# Altium schematic sheet Sheet1.SchDoc
size B; SheetNumber: 1; SheetTotal: 1
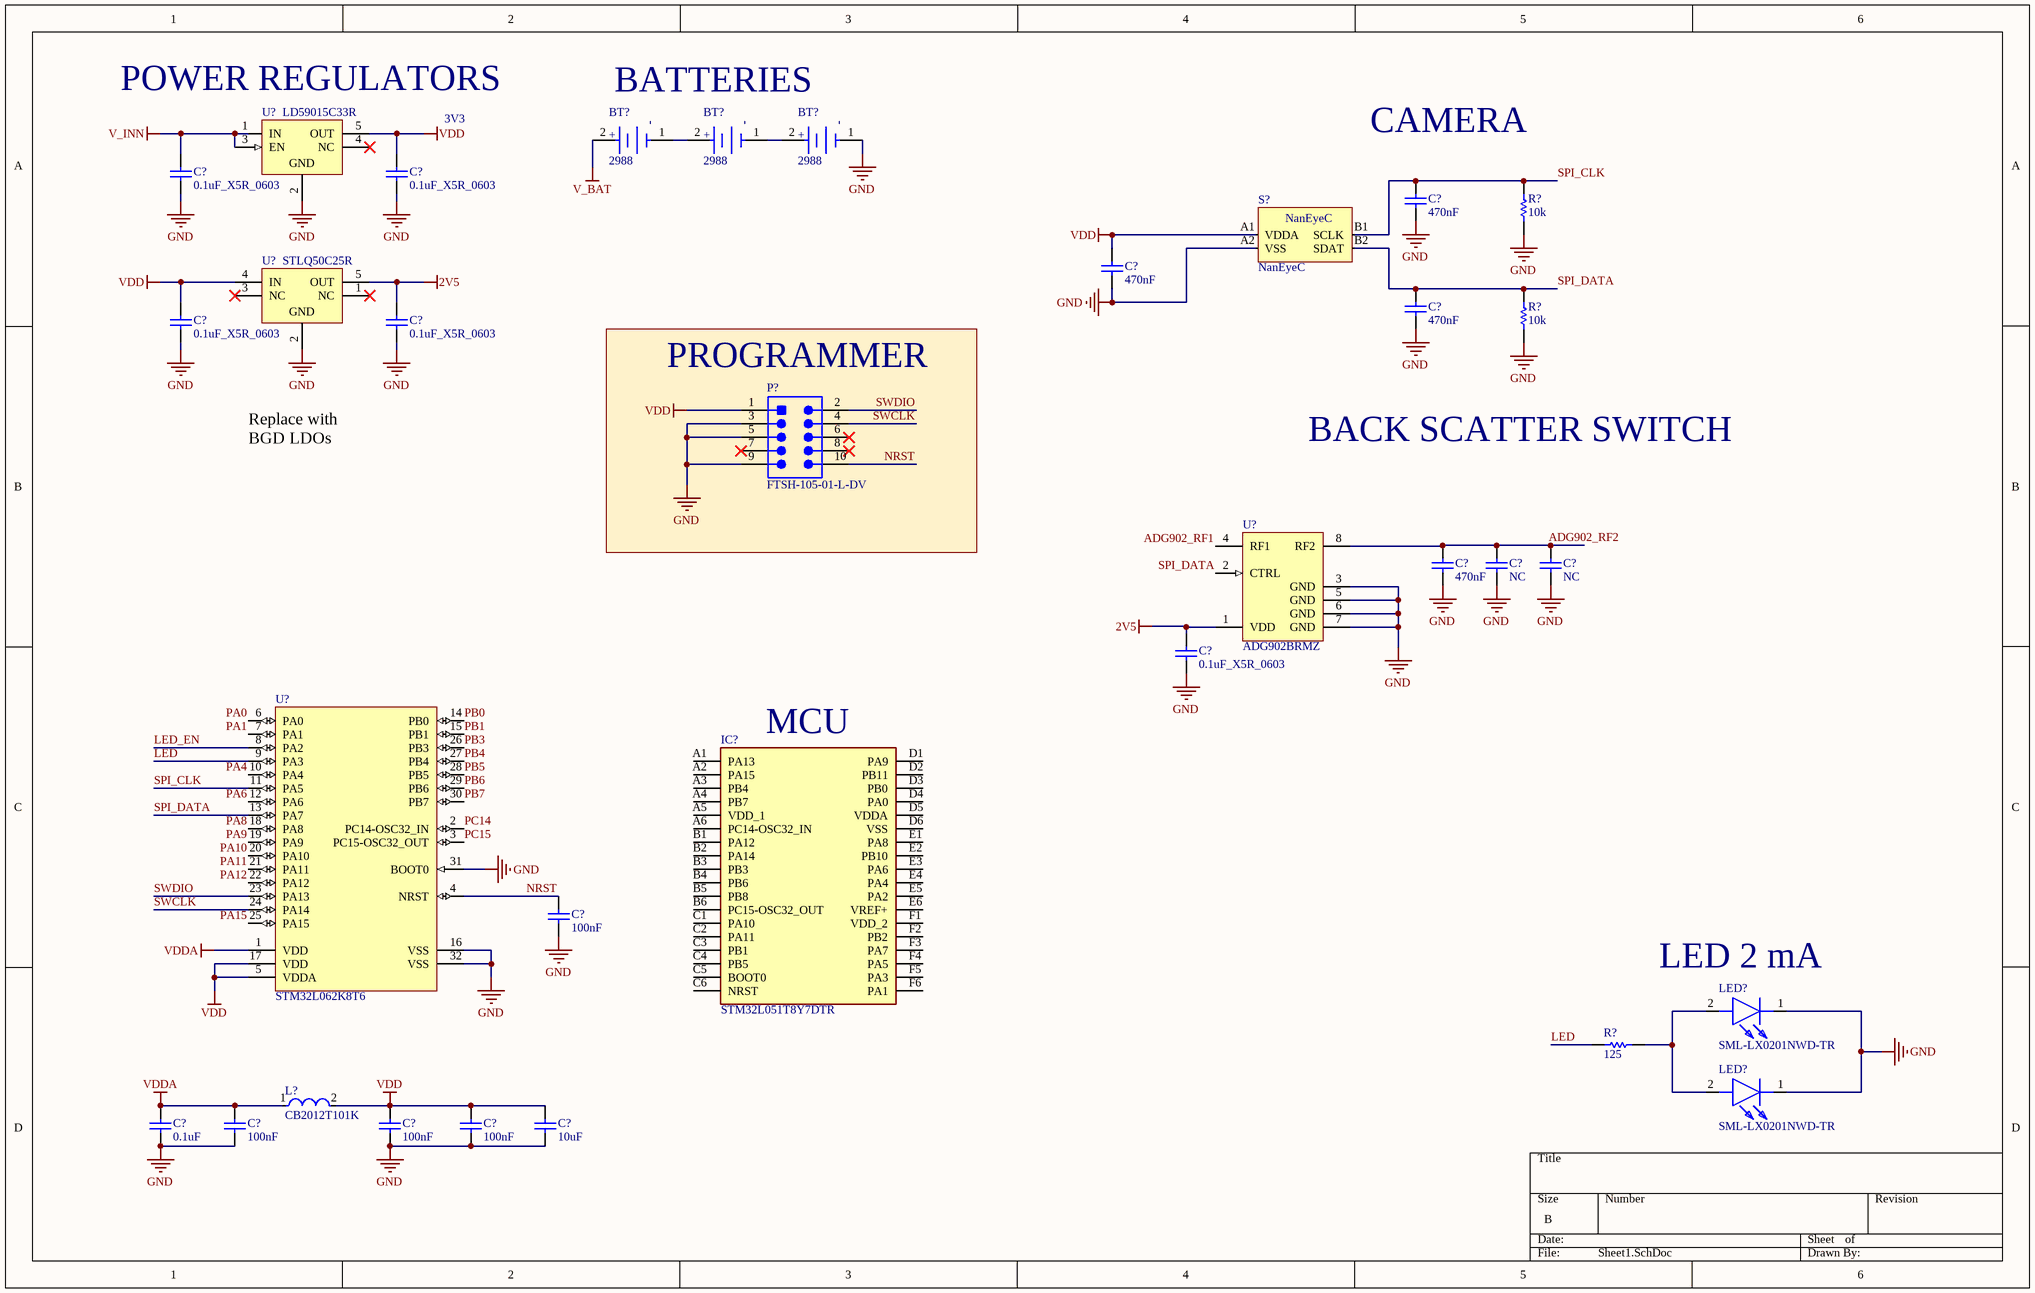
[diagram p0: Sheet1.SchDoc]

## Parts
(Parts that share a designator on the sheet are numbered #1, #2 ... from top to bottom, then left to right.)
BT?#1  2988  [FP-2988-MFG]
BT?#2  2988  [FP-2988-MFG]
BT?#3  2988  [FP-2988-MFG]
C?#1  0.1uF_X5R_0603  [CAPC1608X90X35NL15T15]
C?#2  0.1uF_X5R_0603  [CAPC1608X90X35NL15T15]
C?#3  470nF  [CAPC1608X90X35NL15T15]
C?#4  470nF  [CAPC1608X90X35NL15T15]
C?#5  470nF  [CAPC1608X90X35NL15T15]
C?#6  0.1uF_X5R_0603  [CAPC1608X90X35NL15T15]
C?#7  0.1uF_X5R_0603  [CAPC1608X90X35NL15T15]
C?#8  470nF  [CAPC1608X90X35NL15T15]
C?#9  NC  [CAPC1608X90X35NL15T15]
C?#10  NC  [CAPC1608X90X35NL15T15]
C?#11  0.1uF_X5R_0603  [CAPC1608X90X35NL15T15]
C?#12  100nF  [CAPC1608X90X35NL15T15]
C?#13  0.1uF  [CAPC1608X90X35NL15T15]
C?#14  100nF  [CAPC1608X90X35NL15T15]
C?#15  100nF  [CAPC1608X90X35NL15T15]
C?#16  100nF  [CAPC1608X90X35NL15T15]
C?#17  10uF  [CAPC1608X90X35NL15T15]
IC?  STM32L051T8Y7DTR  [BGA36C40P6X6_261X288X59]
L?  CB2012T101K  [FP-CB2012-MFG]
LED?#1  SML-LX0201NWD-TR  [LEDC0604X46N]
LED?#2  SML-LX0201NWD-TR  [LEDC0604X46N]
P?  FTSH-105-01-L-DV  [SMTC-FTSH-105-01-L-DV_V]
R?#1  10k  [RESC1608X50X30ML20T20]
R?#2  10k  [RESC1608X50X30ML20T20]
R?#3  125  [RESC1608X50X30ML20T20]
S?  NanEyeC  [NanEyeC]
U?#1  LD59015C33R  [SOT323-5L-L036_L]
U?#2  STLQ50C25R  [SOT323-5L_L]
U?#3  ADG902BRMZ  [ADI-RM-8_L]
U?#4  STM32L062K8T6  [STM-LQFP32_M]

## Blocks framed on the sheet
PROGRAMMER: P?

## Nets
2V5: C?#7.2 C?#11.2 U?#2.5(OUT) U?#3.1(VDD)
GND: BT?#3.1(C) C?#1.1 C?#2.1 C?#3.1 C?#4.1 C?#5.1 C?#6.1 C?#7.1 C?#8.1 C?#9.1 C?#10.1 C?#11.1 C?#12.1 C?#13.1 C?#14.1 C?#15.1 C?#16.1 C?#17.1 LED?#1.1(K) LED?#2.1(K) P?.3 P?.5 P?.9 R?#1.1 R?#2.1 S?.A2(VSS) U?#1.2(GND) U?#2.2(GND) U?#3.3(GND) U?#3.5(GND) U?#3.6(GND) U?#3.7(GND) U?#4.16(VSS) U?#4.31(BOOT0) U?#4.32(VSS)
V_BAT: BT?#1.2(A)
V_INN: C?#1.2 U?#1.1(IN) U?#1.3(EN)
VDD: C?#2.2 C?#4.2 C?#6.2 C?#15.2 C?#16.2 C?#17.2 L?.2 P?.1 S?.A1(VDDA) U?#1.5(OUT) U?#2.4(IN) U?#4.5(VDDA) U?#4.17(VDD)
VDDA: C?#13.2 C?#14.2 L?.1 U?#4.1(VDD)
ADG902_RF1: U?#3.4(RF1)
ADG902_RF2: C?#8.2 C?#9.2 C?#10.2 U?#3.8(RF2)
LED: R?#3.2 U?#4.9(PA3)
LED_EN: U?#4.8(PA2)
NRST: C?#12.2 P?.10 U?#4.4(NRST)
PA0: U?#4.6(PA0)
PA1: U?#4.7(PA1)
PA4: U?#4.10(PA4)
PA6: U?#4.12(PA6)
PA8: U?#4.18(PA8)
PA9: U?#4.19(PA9)
PA10: U?#4.20(PA10)
PA11: U?#4.21(PA11)
PA12: U?#4.22(PA12)
PA15: U?#4.25(PA15)
PB0: U?#4.14(PB0)
PB1: U?#4.15(PB1)
PB3: U?#4.26(PB3)
PB4: U?#4.27(PB4)
PB5: U?#4.28(PB5)
PB6: U?#4.29(PB6)
PB7: U?#4.30(PB7)
PC14: U?#4.2(PC14-OSC32_IN)
PC15: U?#4.3(PC15-OSC32_OUT)
SPI_CLK: C?#3.2 R?#1.2 S?.B1(SCLK) U?#4.11(PA5)
SPI_DATA: C?#5.2 R?#2.2 S?.B2(SDAT) U?#3.2(CTRL) U?#4.13(PA7)
SWCLK: P?.4 U?#4.24(PA14)
SWDIO: P?.2 U?#4.23(PA13)
NetBT?#1_1: BT?#1.1(C) BT?#2.2(A)
NetBT?#2_1: BT?#2.1(C) BT?#3.2(A)
NetLED?#1_2: LED?#1.2(A) LED?#2.2(A) R?#3.1

Not connected (* = marked no-connect by the designer): IC? A1(PA13) A2(PA15) A3(PB4) A4(PB7) A5(VDD_1) A6(PC14-OSC32_IN) B1(PA12) B2(PA14) B3(PB3) B4(PB6) B5(PB8) B6(PC15-OSC32_OUT) C1(PA10) C2(PA11) C3(PB1) C4(PB5) C5(BOOT0) C6(NRST) D1(PA9) D2(PB11) D3(PB0) D4(PA0) D5(VDDA) D6(VSS) E1(PA8) E2(PB10) E3(PA6) E4(PA4) E5(PA2) E6(VREF+) F1(VDD_2) F2(PB2) F3(PA7) F4(PA5) F5(PA3) F6(PA1); P? 6* 7* 8*; U?#1 4(NC)*; U?#2 1(NC)* 3(NC)*

## Notes on the sheet
- (near U?#1) POWER REGULATORS
- (near BT?#1) BATTERIES
- 3V3
- CAMERA
- Replace with BGD LDOs
- BACK SCATTER SWITCH
- (near IC?) MCU
- (near LED?#1) LED 2 mA
- (in symbol CMP-19636-000008-1) -; +

## Library data of the parts
BT?#1-BT?#3 = CMP-19636-000008-1: BATTERY RETAINER COIN 7.9MM SMD; Number of Cells: 1; Mount: Surface Mount; Number of Batteries: 1; Package Quantity: 100; Termination: SMD/SMT; REACH SVHC: No SVHC; Case/Package: SMD/SMT
C?#1-C?#17 = CMP-2006-04463-1: Manufacturer: AVX Interconnect / Elco; Part Number: 06035D104KAT2A
IC? = STM32L051T8Y7DTR: Integrated Circuit; Manufacturer_Name: STMicroelectronics; Datasheet Link: https://www.st.com/resource/en/datasheet/stm32l051t8.pdf; Height: 0.59mm; Manufacturer_Part_Number: STM32L051T8Y7DTR; Mouser Part Number: 511-STM32L051T8Y7DTR; Mouser Price/Stock: https://www.mouser.co.uk/ProductDetail/STMicroelectronics/STM32L051T8Y7DTR?qs=mwoc%252BQmZlGI%2FGXp4fwqMCA%3D%3D
L? = CMP-14484-000220-1: SMD Inductors 100uH ±10% 0.13A 9.1Ω 0805; Shielding: Unshielded; Self Resonant Frequency: 8MHz; Saturation Current: 60mA; Core Material: Ferrite; Max DC Current: 130mA; Test Frequency: 796kHz; DC Resistance (DCR): 9.1R; Length: 0.079inch; Min Operating Temperature: -40°C; Termination: SMD/SMT; Series: CB; Inductance: 100uH; Tolerance: 10%; Height - Seated (Max): 0.057inch; Package Quantity: 3000; Radiation Hardening: No; Mount: Surface Mount; Case Code (Metric): 2012; Max Operating Temperature: 105°C; Packaging: Tape and Reel; Width: 0.049inch; RoHS Compliant: Yes; Resistor Type: Wirewound; Halogen Free: Halogen Free; Case Code (Imperial): 0805; Depth: 1.45mm; Inductance Tolerance: 10%; Number of Pins: 2; Height: 0.9mm; Current Rating: 130mA; Lead Free: Lead Free; Case/Package: 0805
LED?#1 LED?#2 = SML-LX0201NWD-TR: LED; Manufacturer_Name: Lumex; Datasheet Link: https://componentsearchengine.com//SML-LX0201NWD-TR.pdf; Height: 0.46mm; Mouser2 Part Number: 696-SMLLX0201NWDTR; Mouser2 Price/Stock: https://www.mouser.com/Search/Refine.aspx?Keyword=696-SMLLX0201NWDTR; Manufacturer_Part_Number: SML-LX0201NWD-TR
P? = CMP-2000-05354-1: Male Header, Pitch 1.27 mm, 2 x 5 Position, Height 5.96 mm, -55 to 125 degC, RoHS, Bulk; Manufacturer: Samtec; Connector Type: Header,Unshrouded; Pitch: 0.050"(1.27mm); Mating Products: FLE-105-01-G-DV-TR-ND-CONNSKT1.27MM10POSDUALSMDCLP-105-02-G-D-P-TR-ND-CONNRCPT10POSDUAL.05"SMDSFMC-105-L2-S-D-TR-ND-CONN.05"SURFACE10POSSMTSFMH-105-02-L-D-TR-ND-CONNRECEPT10POS.50"SMTFLE-105-01-G-DV-A-ND-CONNSKT1.27MM10POSDUALSMDCLP-105-02-G-D-BE-ND-CONNRCPT10POSDUAL.05"SMDFLE-105-01-G-DV-A-P-ND-CONNSKT1.27MM10POSDUALSMDSAM1153-05-ND-CONNRCPT10POSDUAL.05"SMDSAM1155-05-ND-CONNRCPT10POSDUAL.05"SMDSAM1154-05-ND-CONNRCPT10POSDUAL.05"SMDSFMH-105-02-L-D-LC-ND-CONNRECEPT10POS.50"SMTSAM1226-05-ND-CONNRCPT.05"10POSDUALSMD; Catalog Drawings: FTSHSeriesFTSHSeriesSMTSide; Other Names: SAM1161-05; EDA / CAD Models: DownloadfromAcceleratedDesigns; Number of Positions Loaded: All; Number of Positions: 10; Featured Product: Board-To-BoardInterconnectSystems; Online Catalog: FTSHSeries; Product Training Modules: Board-to-BoardConnectors; Category: Connectors,Interconnects; Number of Rows: 2; Contact Finish: Gold; Termination: Solder; Mounting Type: SurfaceMount; Series: FTSH; Contact Mating Length: 0.120"(3.05mm); Row Spacing: 0.050"(1.27mm); Datasheet URL: https://datasheet.ciiva.com/30493/0900766b80adfe36-30493006.pdf; Contact Finish Thickness: 10µin(0.25µm); Features: -; Standard Package: 1; Packaging: Bulk; Datasheet Version: Feb-08; Manufacturer URL: http://www.samtec.com/; Fastening Type: -; Family: RectangularConnectors-Headers,MalePins; Contact Type: MalePin; Color: Black
R?#1-R?#3 = CMP-2000-02665-1: Part Number: RR0816P-4640-D-65A; Manufacturer: Susumu
S? = NanEyeC: Camera module NanEyeC from AMS
U?#1 = CMP-0244-00349-1: 150 mA Low Noise High PSRR linear Voltage Regulator, 3.3V, 5-Pin SOT-323, Tape and Reel; PackageDescription: 5-Pin SOT-323 Package, 2 x 1.3 mm Body, 0.65 mm Pitch, 2.1 mm Lead Span; ComponentLink2Description: Datasheet; PackageReference: SOT323-5L-L036; ComponentLink1Description: Manufacturer URL; ComponentLink2URL: http://www.st.com/internet/com/TECHNICAL_RESOURCES/TECHNICAL_LITERATURE/DATASHEET/CD00273252.pdf; DatasheetVersion: 1/12/2011; ComponentLink1URL: http://www.st.com; PackageVersion: 1/01/2011
U?#2 = CMP-0244-00360-1: 50mA, 3µA Supply Current Low Drop Linear Regulator, 2.5V, 5-Pin SOT-323, Tape and Reel; ComponentLink2Description: Datasheet; PackageReference: SOT323-5L; DatasheetVersion: 1/11/2007; PackageVersion: 1/01/2006; ComponentLink1URL: http://www.st.com; ComponentLink2URL: http://www.st.com/internet/com/TECHNICAL_RESOURCES/TECHNICAL_LITERATURE/DATASHEET/CD00151464.pdf; PackageDescription: 5-Pin SOT-323 Package, 2 x 1.3 mm Body, 0.65 mm Pitch, 2.1 mm Lead Span; ComponentLink1Description: Manufacturer URL
U?#3 = CMP-0290-00054-1: RF Switch, Wideband, 40 dB Isolation at 1 GHz, CMOS 1.65 V to 2.75 V, SPST Switches, RM-8, Pb-Free, 50 Tube; Configuration: SPST/NO; Off Isolation: 37dB; # Sw Functions: 1; P-1dB (dBm): 17; Supply Voltage: Single (+1.65V to +2.75V); Off Isolation Test Freq: 1G; Insertion Loss (dB): 800mdB; Bandwidth: 4.5GHz; ComponentLink1URL: www.analog.com; ComponentLink2URL: http://www.analog.com/static/imported-files/data_sheets/ADG901_902.pdf; ComponentLink3URL: http://www.analog.com/static/imported-files/packages/PKG_PDF/MSOP%28RM%29/RM_8.pdf; ComponentLink1Description: Manufacturer URL; PackageVersion: Aug-2005; PackageDescription: 8-Lead Mini Small Outline Package [MSOP]; ComponentLink3Description: Package Specification; ComponentLink2Description: Datasheet; PackageReference: RM-8; DatasheetVersion: RevB; Code_JEDEC: MO-187-AA
U?#4 = CMP-1546-00066-1: Ultra-Low-Power ARM Cortex-M0+ MCU, 64 KB Flash, 8 KB Internal RAM, 27 I/Os, 32-Pin LQFP, -40 to 85 degC, Tray; Internal RAM Size (kB): 8; I/Os (High Current): 27; D/A Converter: 1; Operating Frequency(F) (Processor speed) (MHz): 32; Supply Voltage(Vcc) min (V): 1.65; FLASH Size (Prog) (kB): 64; Data E2PROM nom (B): 2048; ComponentLink2Description: Datasheet; DatasheetVersion: Rev. 7; ComponentLink2URL: http://www.st.com/st-web-ui/static/active/en/resource/technical/document/datasheet/DM00108218.pdf; Core: ARM Cortex-M0+; Package Reference: LQFP32; ComponentLink1Description: Manufacturer URL; Package Description: 32-Pin Low Profile Quad Flat Package, 7 x 7 mm Body, 0.8 mm Pitch; Mounting Technology: Surface Mount; ComponentLink1URL: http://www.st.com/; Packing: Tray